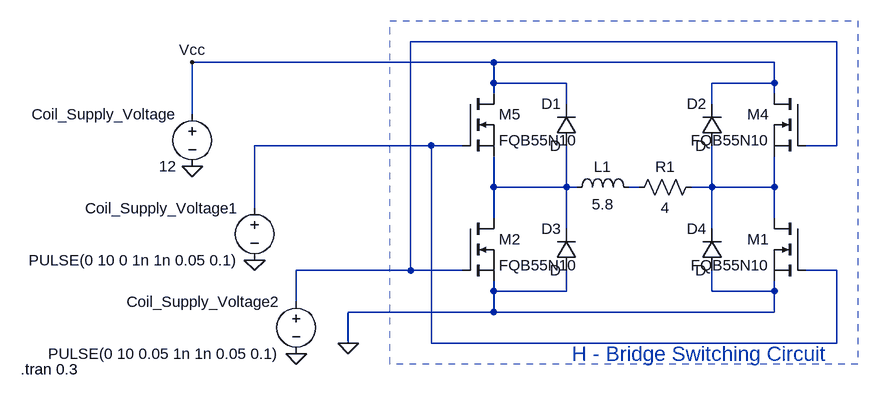
[diagram p0: schematic hbridge.asc]
hbridge.asc, the LTspice schematic file:
Version 4
SHEET 1 1156 1060
WIRE 800 224 144 224
WIRE 272 256 -192 256
WIRE 704 256 272 256
WIRE 272 288 272 256
WIRE 384 288 272 288
WIRE 704 288 704 256
WIRE 704 288 608 288
WIRE 272 304 272 288
WIRE 704 304 704 288
WIRE 384 320 384 288
WIRE 608 320 608 288
WIRE -192 336 -192 256
WIRE 176 384 -96 384
WIRE 224 384 176 384
WIRE 800 384 800 224
WIRE 800 384 752 384
WIRE 272 448 272 400
WIRE 384 448 384 384
WIRE 384 448 272 448
WIRE 400 448 384 448
WIRE 496 448 480 448
WIRE 608 448 608 384
WIRE 608 448 576 448
WIRE 704 448 704 400
WIRE 704 448 608 448
WIRE -96 480 -96 384
WIRE 272 496 272 448
WIRE 704 496 704 448
WIRE 384 512 384 448
WIRE 608 512 608 448
WIRE 144 576 144 224
WIRE 144 576 -32 576
WIRE 224 576 144 576
WIRE 800 576 752 576
WIRE 272 608 272 592
WIRE 384 608 384 576
WIRE 384 608 272 608
WIRE 608 608 608 576
WIRE 704 608 704 592
WIRE 704 608 608 608
WIRE -32 624 -32 576
WIRE 272 640 272 608
WIRE 272 640 48 640
WIRE 704 640 704 608
WIRE 704 640 272 640
WIRE 48 688 48 640
WIRE 176 688 176 384
WIRE 800 688 800 576
WIRE 800 688 176 688
FLAG 48 688 0
FLAG -192 416 0
FLAG -192 256 Vcc
FLAG -96 560 0
FLAG -32 704 0
SYMBOL diode 400 384 R180
WINDOW 0 24 64 Left 2
WINDOW 3 24 0 Left 2
SYMATTR InstName D1
SYMBOL diode 624 384 R180
WINDOW 0 24 64 Left 2
WINDOW 3 24 0 Left 2
SYMATTR InstName D2
SYMBOL diode 400 576 R180
WINDOW 0 24 64 Left 2
WINDOW 3 24 0 Left 2
SYMATTR InstName D3
SYMBOL diode 624 576 R180
WINDOW 0 24 64 Left 2
WINDOW 3 24 0 Left 2
SYMATTR InstName D4
SYMBOL ind 384 464 R270
WINDOW 0 32 56 VTop 2
WINDOW 3 5 56 VBottom 2
SYMATTR InstName L1
SYMATTR Value 5.8
SYMBOL res 480 464 R270
WINDOW 0 32 56 VTop 2
WINDOW 3 0 56 VBottom 2
SYMATTR InstName R1
SYMATTR Value 4
SYMBOL voltage -192 320 M0
WINDOW 123 0 0 Left 2
WINDOW 39 0 0 Left 2
SYMATTR InstName Coil_Supply_Voltage
SYMATTR Value 12
SYMBOL nmos 224 304 R0
SYMATTR InstName M5
SYMATTR Value FQB55N10
SYMBOL voltage -96 464 M0
WINDOW 123 0 0 Left 2
WINDOW 39 0 0 Left 2
SYMATTR InstName Coil_Supply_Voltage1
SYMATTR Value PULSE(0 10 0 1n 1n 0.05 0.1)
SYMBOL voltage -32 608 M0
WINDOW 123 0 0 Left 2
WINDOW 39 0 0 Left 2
SYMATTR InstName Coil_Supply_Voltage2
SYMATTR Value PULSE(0 10 0.05 1n 1n 0.05 0.1)
SYMBOL nmos 752 304 M0
SYMATTR InstName M4
SYMATTR Value FQB55N10
SYMBOL nmos 752 496 M0
SYMATTR InstName M1
SYMATTR Value FQB55N10
SYMBOL nmos 224 496 R0
SYMATTR InstName M2
SYMATTR Value FQB55N10
TEXT 392 704 Left 3 ;H - Bridge Switching Circuit
TEXT -456 728 Left 2 !.tran 0.3
RECTANGLE Normal 832 720 112 192 1

The netlist it stands for:
* hbridge.asc
D1 N003 Vcc D
D2 N005 Vcc D
D3 0 N003 D
D4 0 N005 D
L1 N003 N004 5.8
R1 N004 N005 4
V§Coil_Supply_Voltage Vcc 0 12
M5 Vcc N002 N003 N003 FQB55N10
V§Coil_Supply_Voltage1 N002 0 PULSE(0 10 0 1n 1n 0.05 0.1)
V§Coil_Supply_Voltage2 N001 0 PULSE(0 10 0.05 1n 1n 0.05 0.1)
M4 Vcc N001 N005 N005 FQB55N10
M1 N005 N002 0 0 FQB55N10
M2 N003 N001 0 0 FQB55N10
.model D D
.lib standard.dio
.model NMOS NMOS
.model PMOS PMOS
.lib standard.mos
* H - Bridge Switching Circuit
.tran 0.3
.backanno
.end